# Altium project 2364 Adapter.PrjPcb
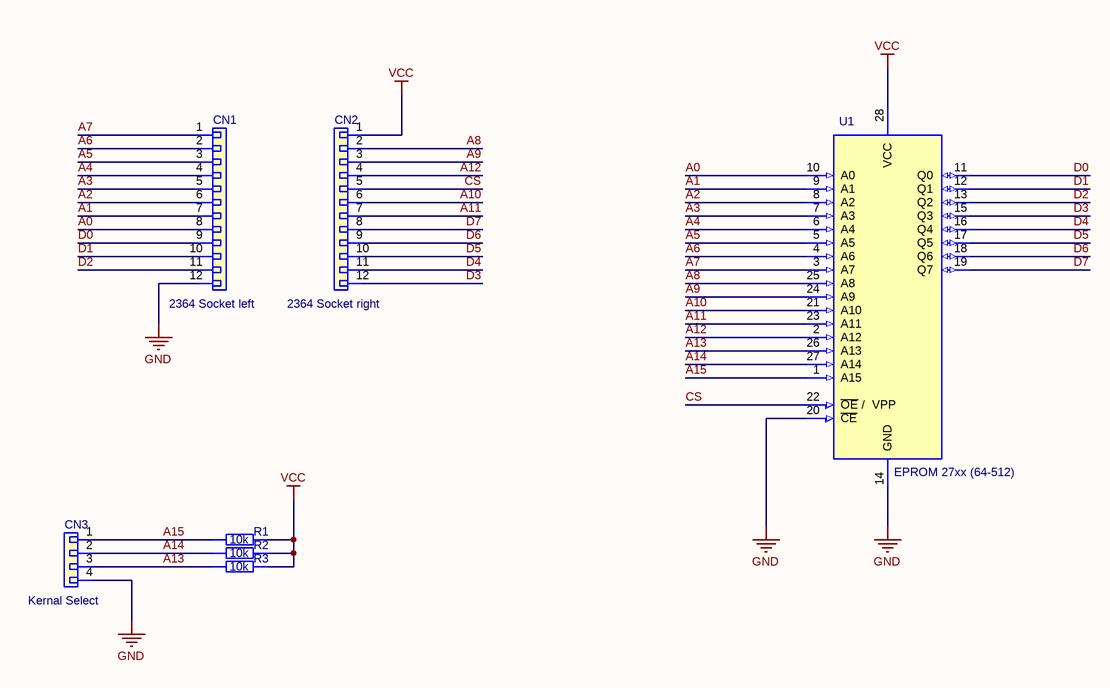
[diagram p0: 2364 Adapter.SchDoc]
Author: PCB-Tech; Revision: -; Title: Projektname; Version: 1.0
1 sheet, 7 parts. Net scope: global (net labels, ports and power ports of the same name join across sheets).
Board files: 2364 Adapter.PcbDoc, 2364 Adapter Panel.PcbDoc

## Sheet 2364 Adapter.SchDoc: Projektname
size 297 x 209 mm; ApprovedBy: .; CheckedBy: .; Author: DiWou; CompanyName: DL2DW; DrawnBy: DiWou; Engineer: DiWou; Organization: DL2DW; DocumentNumber: 1; Revision: -; SheetNumber: 1; SheetTotal: 1; DrawnDate: 04.03.2017; EngrDate: 04.03.2017; ChkdDate: .; Title1: 2364 Adapter; Title2: 2764-27512 to 2364; Title3: .; Desc1: Version 1.0; Desc2: .; ApprDate: .

### Parts
CN1  2364 Socket left  [Pin Header 01x12 2.54mm Horizontal Male]
CN2  2364 Socket right  [Pin Header 01x12 2.54mm Horizontal Male]
CN3  Kernal Select  [Pin Header 01x04 2.54mm Horizontal Male]
R1  10k  [10 kOhm R Axial DIN0207 L6.3mm D2.5mm P7.62mm Horizontal]
R2  10k  [10 kOhm R Axial DIN0207 L6.3mm D2.5mm P7.62mm Horizontal]
R3  10k  [10 kOhm R Axial DIN0207 L6.3mm D2.5mm P7.62mm Horizontal]
U1  EPROM 27xx (64-512)  [Winbond W27C512-45Z DIP-28 with Socket]

### Nets
GND: CN1.12 CN3.4 U1.14(GND) U1.20(~{CE})
VCC: CN2.1 R1.2 R2.2 R3.2 U1.28(VCC)
A0: CN1.8 U1.10(A0)
A1: CN1.7 U1.9(A1)
A2: CN1.6 U1.8(A2)
A3: CN1.5 U1.7(A3)
A4: CN1.4 U1.6(A4)
A5: CN1.3 U1.5(A5)
A6: CN1.2 U1.4(A6)
A7: CN1.1 U1.3(A7)
A8: CN2.2 U1.25(A8)
A9: CN2.3 U1.24(A9)
A10: CN2.6 U1.21(A10)
A11: CN2.7 U1.23(A11)
A12: CN2.4 U1.2(A12)
A13: CN3.3 R3.1 U1.26(A13)
A14: CN3.2 R2.1 U1.27(A14)
A15: CN3.1 R1.1 U1.1(A15)
CS: CN2.5 U1.22(~{OE}_/__VPP)
D0: CN1.9 U1.11(Q0)
D1: CN1.10 U1.12(Q1)
D2: CN1.11 U1.13(Q2)
D3: CN2.12 U1.15(Q3)
D4: CN2.11 U1.16(Q4)
D5: CN2.10 U1.17(Q5)
D6: CN2.9 U1.18(Q6)
D7: CN2.8 U1.19(Q7)

### Notes on the sheet
- Drawn by:
- Date
- Size:
- A4
- Rev:
- Engr:
- Chkd:
- Appr:
- File:
- Document No:
- Print Date & Time:
- /
- Sheet
- of

### Library data of the parts
CN1 CN2 = CMP-Connectors-Male_PIN_Headers-00011-3: CONN HEADER .100 SNGL STR 12POS; Pitch: 0.1inch; Connector Type: Male Pin; Number of Positions: 12; Color: Black; Number of Rows: 1; Contact Mating Length: 0.318inch; Termination: Solder; Mount: Through Hole; Packaging: Bulk; Contact Plating: Gold; Package Quantity: 1
CN3 = CMP-Connectors-Male_PIN_Headers-00003-3: CONN HEADER .100" SNGL STR 4POS; Pitch: 0.1inch; Connector Type: Male Pin; Number of Positions: 4; Contact Plating: Gold; Package Quantity: 1; Number of Rows: 1; Packaging: Bulk; Contact Mating Length: 0.318inch; Termination: Solder; Color: Black; Mount: Through Hole
R1-R3 = CMP-Resistors-Yageo_THT_DIN_0207-00096-1: RES 10K OHM 1/4W 5% AXIAL; Resistance: 10kR; Temperature Coefficient: 500ppm/°C; Max Power Dissipation: 250mW; Case/Package: Axial; Number of Terminations: 2; Composition: Carbon Film; Packaging: Bulk; Min Operating Temperature: -55°C; Lead Free: Lead Free; Package Quantity: 200; Max Operating Temperature: 155°C; Length: 0.248inch; Tolerance: 5%
U1 = CMP-ICs-Memory-00001-2: IC EEPROM 512KBIT 45NS 28DIP; Interface: Parallel; Density: 512Kb; Frequency: 45GHz; Operating Supply Voltage: 5V; Memory Size: 512000B; Case/Package: DIP; Memory Type: EEPROM; Number of Pins: 28; Lead Free: Lead Free; Package Quantity: 15; Packaging: Rail/Tube; Radiation Hardening: No; Access Time: 45ns; Min Operating Temperature: 0°C; Max Operating Temperature: 70°C